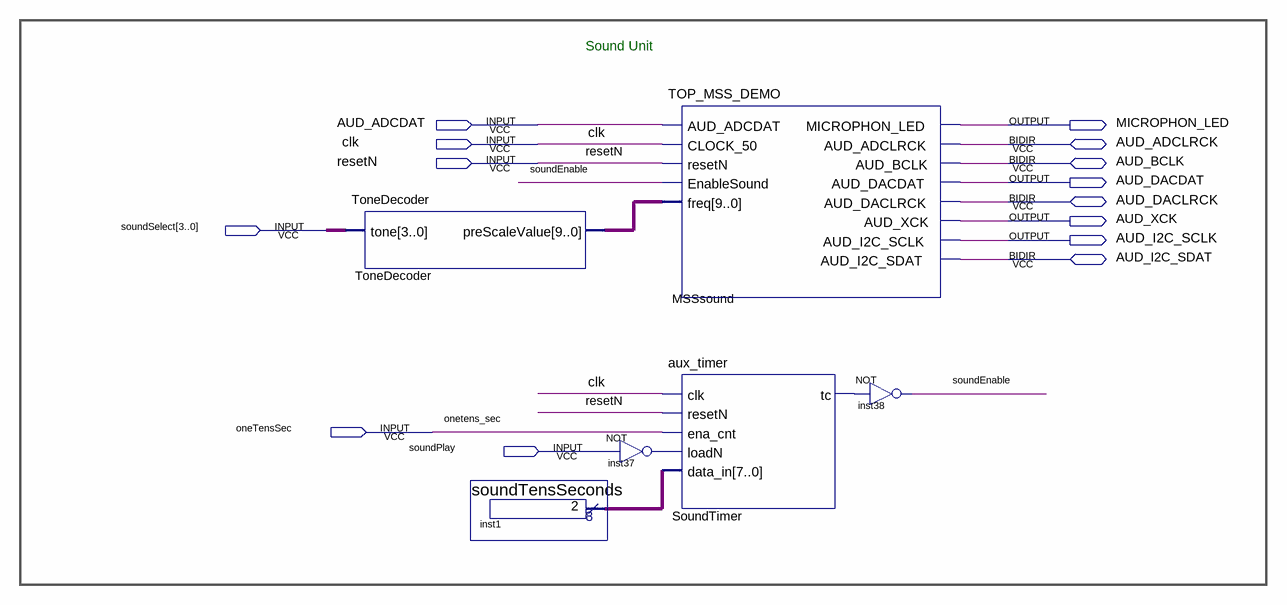
[diagram p0: schematic sheet]
// Quartus schematic SOUND_PLAYER.bdf as structural Verilog: 6 symbols, 14 pins
module SOUND_PLAYER (
  input  AUD_ADCDAT,
  input  clk,
  input  resetN,
  input  [3:0] soundSelect,
  input  oneTensSec,
  input  soundPlay,
  inout  AUD_ADCLRCK,
  inout  AUD_BCLK,
  inout  AUD_DACLRCK,
  inout  AUD_I2C_SDAT,
  output MICROPHON_LED,
  output AUD_DACDAT,
  output AUD_XCK,
  output AUD_I2C_SCLK
);

  wire inst37_out, soundEnable, SoundTimer_tc;
  wire [7:0] inst1_result;
  wire [9:0] ToneDecoder_prescalevalue;

  ToneDecoder ToneDecoder (.tone(soundSelect), .preScaleValue(ToneDecoder_prescalevalue));
  soundTensSeconds inst1 (.result(inst1_result));
  not inst37 (inst37_out, soundPlay);
  TOP_MSS_DEMO MSSsound (
    .AUD_ADCDAT(AUD_ADCDAT), .CLOCK_50(clk), .resetN(resetN), .EnableSound(soundEnable),
    .freq(ToneDecoder_prescalevalue), .MICROPHON_LED(MICROPHON_LED), .AUD_DACDAT(AUD_DACDAT),
    .AUD_XCK(AUD_XCK), .AUD_I2C_SCLK(AUD_I2C_SCLK), .AUD_ADCLRCK(AUD_ADCLRCK), .AUD_BCLK(AUD_BCLK),
    .AUD_DACLRCK(AUD_DACLRCK), .AUD_I2C_SDAT(AUD_I2C_SDAT));
  aux_timer SoundTimer (
    .clk(clk), .resetN(resetN), .ena_cnt(oneTensSec), .loadN(inst37_out), .data_in(inst1_result),
    .tc(SoundTimer_tc));
  not inst38 (soundEnable, SoundTimer_tc);

  // Other names for the same wires on the sheet: onetens_sec = oneTensSec

  // Notes on the sheet:
  //   Sound Unit
endmodule
